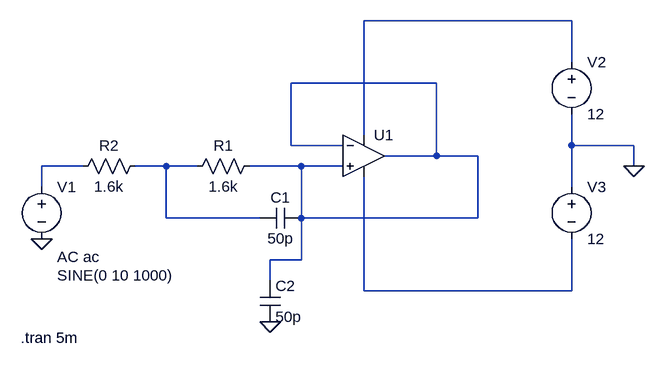
[diagram p0: schematic 2nd-order-low-pass-filter.asc]
2nd-order-low-pass-filter.asc, the LTspice schematic file:
Version 4.1
SHEET 1 1956 680
WIRE 736 -80 416 -80
WIRE 736 -16 736 -80
WIRE 528 16 304 16
WIRE 416 96 416 -80
WIRE 304 112 304 16
WIRE 384 112 304 112
WIRE 736 112 736 64
WIRE 832 112 736 112
WIRE 528 128 528 16
WIRE 528 128 448 128
WIRE 592 128 528 128
WIRE -16 144 -80 144
WIRE 112 144 64 144
WIRE 160 144 112 144
WIRE 320 144 240 144
WIRE 384 144 320 144
WIRE 832 144 832 112
WIRE -80 176 -80 144
WIRE 736 176 736 112
WIRE 112 224 112 144
WIRE 256 224 112 224
WIRE 320 224 320 144
WIRE 592 224 592 128
WIRE 592 224 320 224
WIRE 320 288 320 224
WIRE 320 288 272 288
WIRE 272 320 272 288
WIRE 416 336 416 160
WIRE 736 336 736 256
WIRE 736 336 416 336
FLAG 272 384 0
FLAG -80 256 0
FLAG 832 144 0
SYMBOL res 256 128 R90
WINDOW 0 0 56 VBottom 2
WINDOW 3 32 56 VTop 2
SYMATTR InstName R1
SYMATTR Value 1.6k
SYMBOL res 80 128 R90
WINDOW 0 0 56 VBottom 2
WINDOW 3 32 56 VTop 2
SYMATTR InstName R2
SYMATTR Value 1.6k
SYMBOL cap 320 208 R90
WINDOW 0 0 32 VBottom 2
WINDOW 3 32 32 VTop 2
SYMATTR InstName C1
SYMATTR Value 50p
SYMBOL cap 256 320 R0
SYMATTR InstName C2
SYMATTR Value 50p
SYMBOL voltage -80 160 R0
WINDOW 3 24 152 Left 2
WINDOW 123 24 124 Left 2
WINDOW 39 0 0 Left 0
SYMATTR Value SINE(0 10 1000)
SYMATTR Value2 AC ac
SYMATTR InstName V1
SYMBOL voltage 736 -32 R0
WINDOW 123 0 0 Left 0
WINDOW 39 0 0 Left 0
SYMATTR InstName V2
SYMATTR Value 12
SYMBOL voltage 736 160 R0
WINDOW 123 0 0 Left 0
WINDOW 39 0 0 Left 0
SYMATTR InstName V3
SYMATTR Value 12
SYMBOL OpAmps\\UniversalOpAmp 416 128 R0
SYMATTR InstName U1
TEXT -112 408 Left 2 !.tran 5m

The netlist it stands for:
* 2nd-order-low-pass-filter.asc
R1 N002 N004 1.6k
R2 N004 N003 1.6k
C1 N002 N004 50p
C2 N002 0 50p
V1 N003 0 SINE(0 10 1000) AC ac
V2 N001 0 12
V3 0 N005 12
X§U1 N002 N002 N001 N005 N002 level1 Avol=1Meg GBW=10Meg Vos=0 En=0 Enk=0 In=0 Ink=0 Rin=500Meg  ; pins In+ In- V+ V- OUT
.tran 5m
.lib UniversalOpAmp1.lib
.backanno
.end